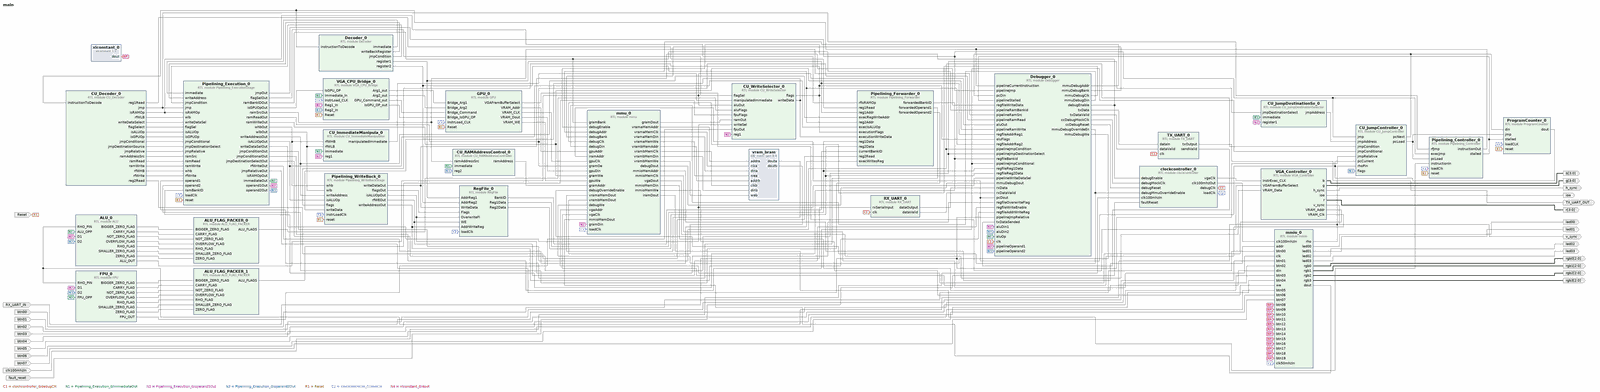
[diagram p0: block diagram of the top level, whole]
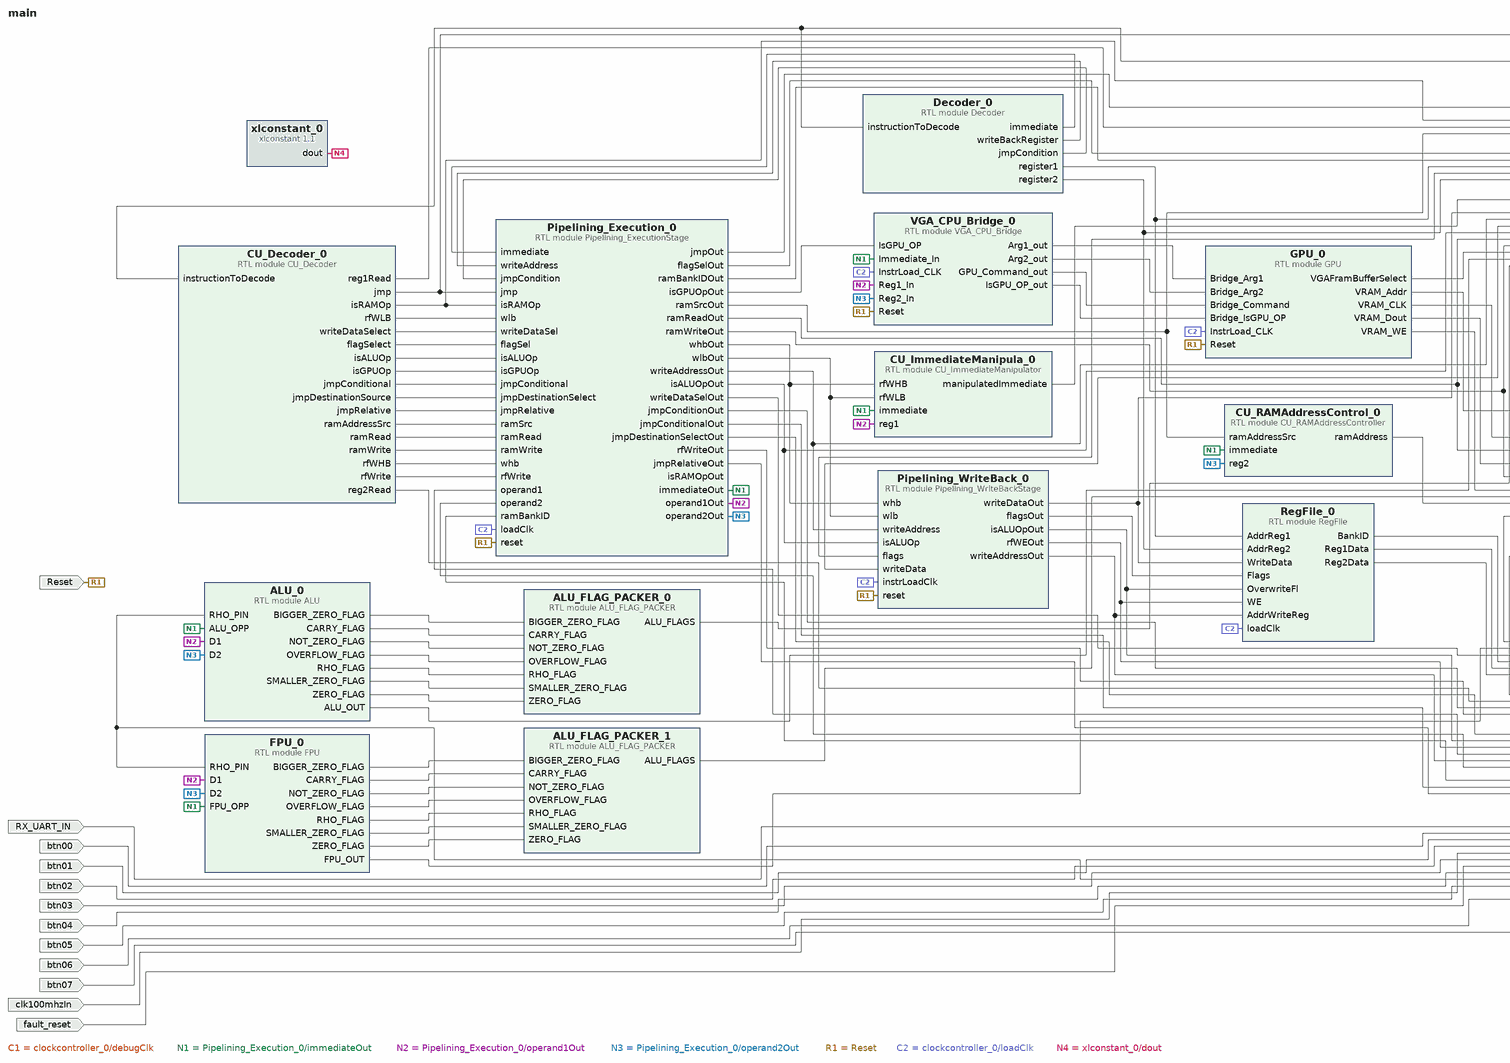
[diagram p1: block diagram of the top level, left part]
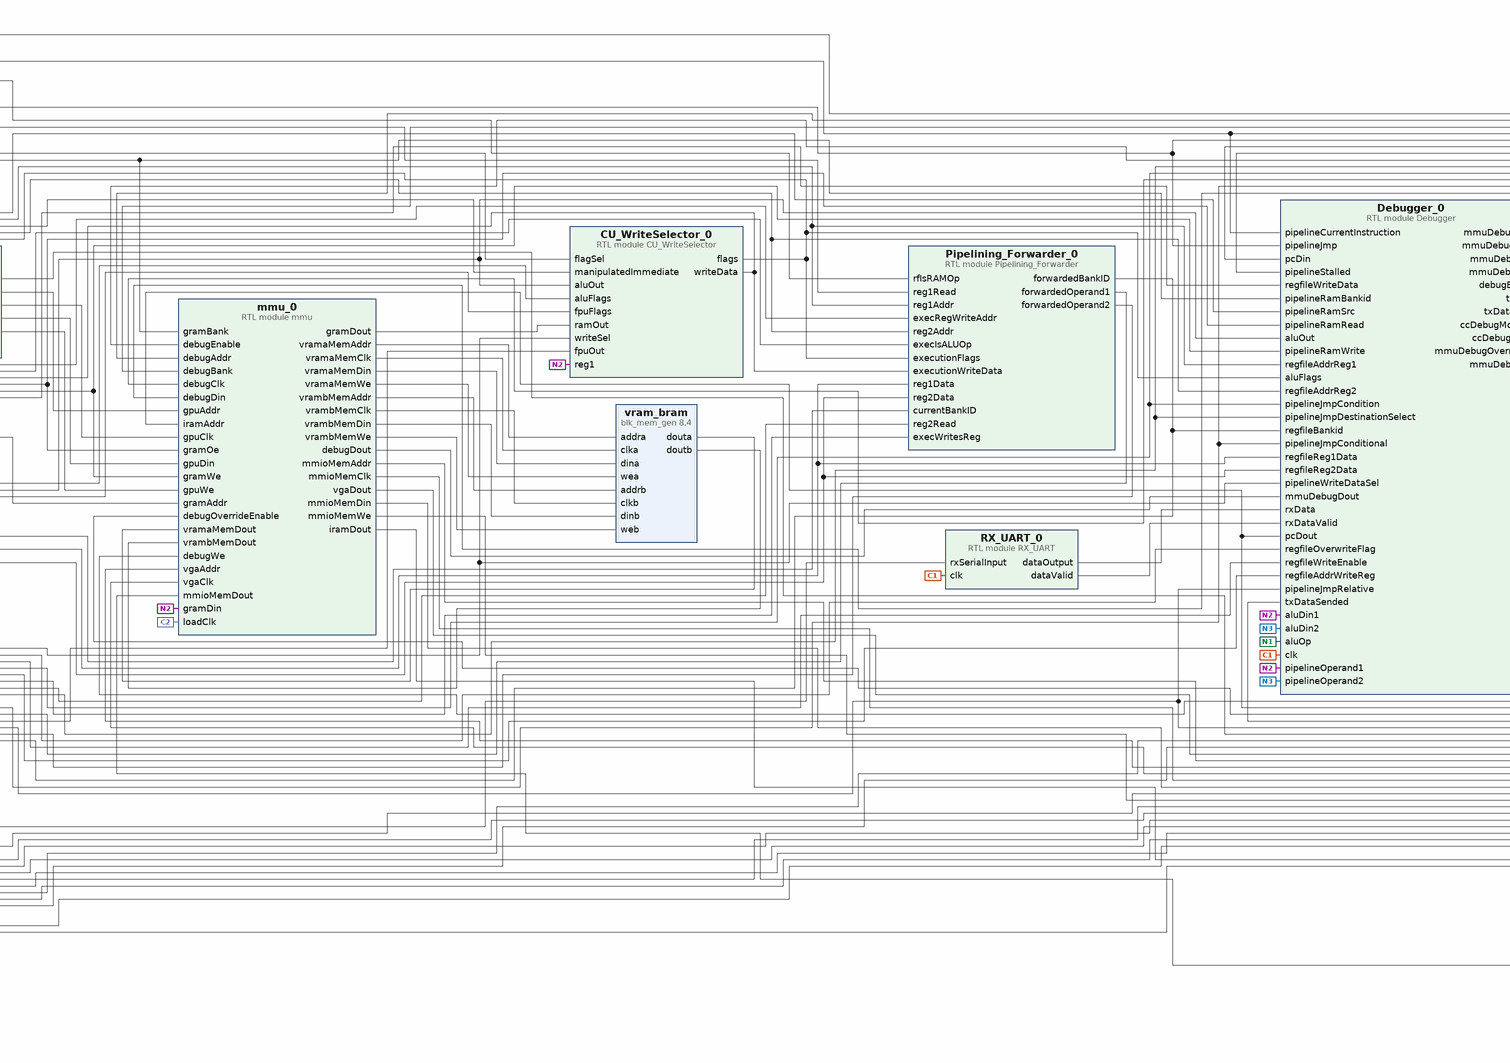
[diagram p2: block diagram of the top level, centre part]
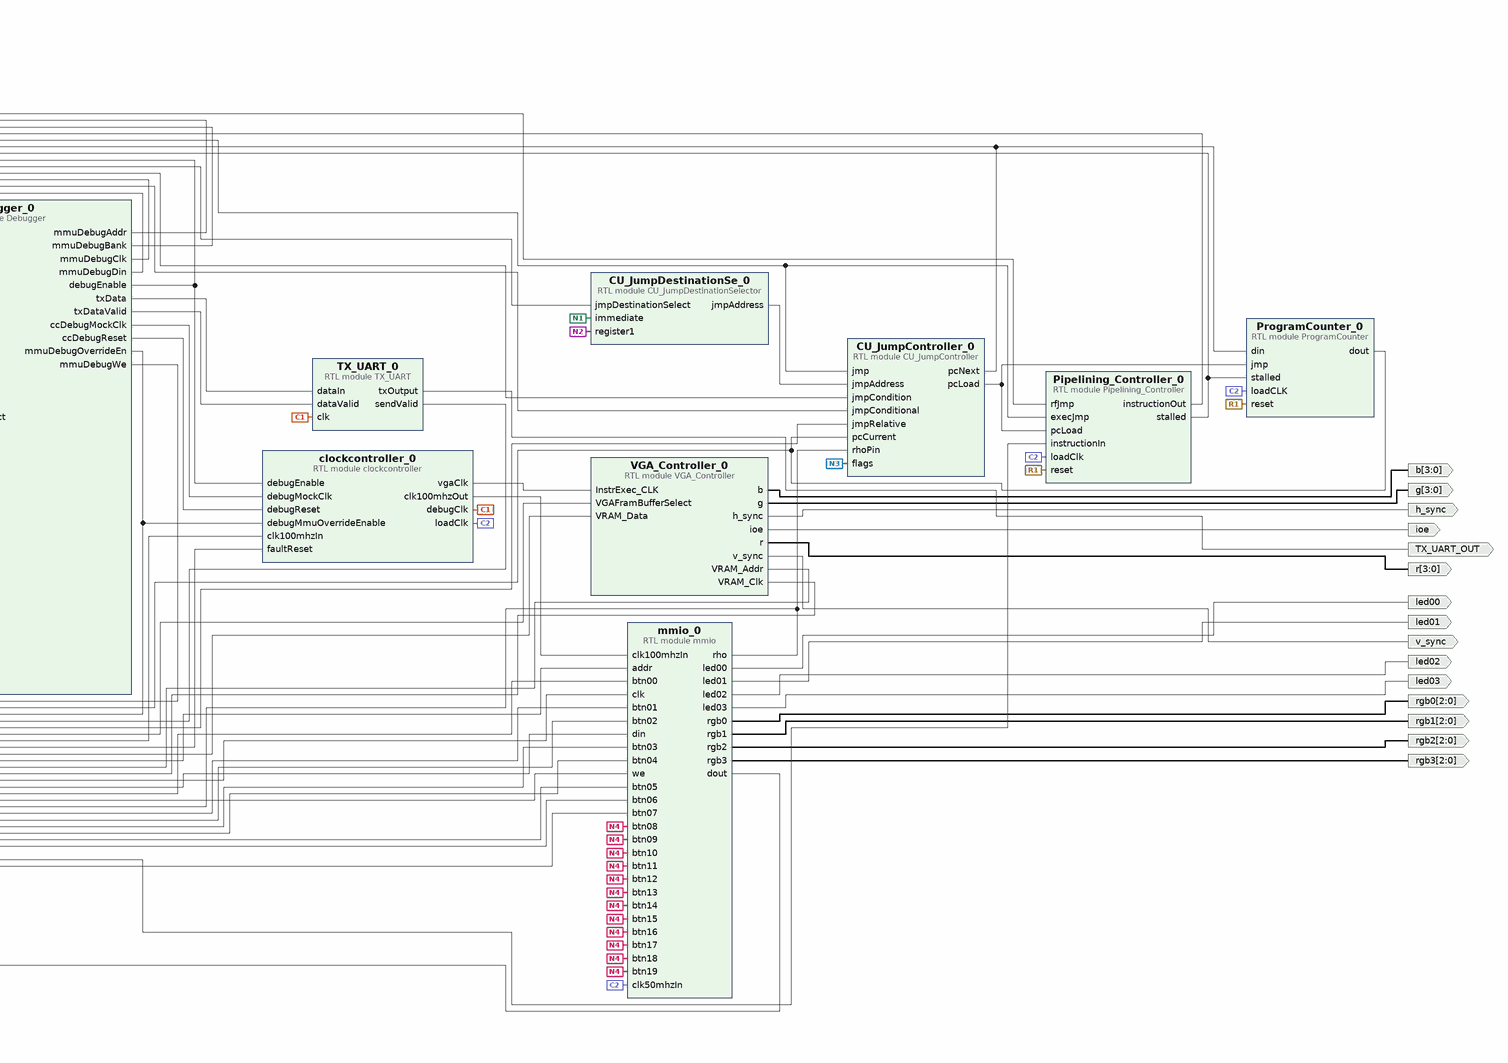
[diagram p3: block diagram of the top level, right part]
# Vivado block design main, xc7a35ticsg324-1L, Vivado 2024.1
create_bd_design main

create_bd_port -dir I -type rst Reset
create_bd_port -dir I RX_UART_IN
create_bd_port -dir O TX_UART_OUT
create_bd_port -dir O -from 3 -to 0 r
create_bd_port -dir O -from 3 -to 0 g
create_bd_port -dir O -from 3 -to 0 b
create_bd_port -dir O ioe
create_bd_port -dir O h_sync
create_bd_port -dir O v_sync
create_bd_port -dir I -type rst fault_reset
create_bd_port -dir O led00
create_bd_port -dir O led01
create_bd_port -dir O led02
create_bd_port -dir O led03
create_bd_port -dir O -from 2 -to 0 rgb0
create_bd_port -dir O -from 2 -to 0 rgb1
create_bd_port -dir O -from 2 -to 0 rgb2
create_bd_port -dir O -from 2 -to 0 rgb3
create_bd_port -dir I btn00
create_bd_port -dir I btn01
create_bd_port -dir I btn02
create_bd_port -dir I btn03
create_bd_port -dir I -type clk clk100mhzIn
set_property -dict {CONFIG.FREQ_HZ 100000000} [get_bd_ports clk100mhzIn]
create_bd_port -dir I btn04
create_bd_port -dir I btn05
create_bd_port -dir I btn06
create_bd_port -dir I btn07

create_bd_cell -type module -reference Pipelining_Controller Pipelining_Controller_0
create_bd_cell -type module -reference ProgramCounter ProgramCounter_0
create_bd_cell -type module -reference CU_Decoder CU_Decoder_0
create_bd_cell -type module -reference Decoder Decoder_0
create_bd_cell -type module -reference RegFile RegFile_0
create_bd_cell -type module -reference Pipelining_Forwarder Pipelining_Forwarder_0
create_bd_cell -type module -reference Pipelining_ExecutionStage Pipelining_Execution_0
create_bd_cell -type module -reference CU_RAMAddressController CU_RAMAddressControl_0
create_bd_cell -type module -reference ALU ALU_0
create_bd_cell -type module -reference CU_ImmediateManipulator CU_ImmediateManipula_0
create_bd_cell -type module -reference CU_JumpDestinationSelector CU_JumpDestinationSe_0
create_bd_cell -type module -reference CU_JumpController CU_JumpController_0
create_bd_cell -type module -reference CU_WriteSelector CU_WriteSelector_0
create_bd_cell -type module -reference Pipelining_WriteBackStage Pipelining_WriteBack_0
create_bd_cell -type module -reference ALU_FLAG_PACKER ALU_FLAG_PACKER_0
create_bd_cell -type module -reference clockcontroller clockcontroller_0
create_bd_cell -type module -reference mmu mmu_0
create_bd_cell -type module -reference mmio mmio_0
create_bd_cell -type ip -vlnv xilinx.com:ip:blk_mem_gen:8.4 vram_bram
set_property -dict [list \
  CONFIG.Algorithm Fixed_Primitives \
  CONFIG.Enable_A Always_Enabled \
  CONFIG.Enable_B Always_Enabled \
  CONFIG.Memory_Type True_Dual_Port_RAM \
  CONFIG.Operating_Mode_A READ_FIRST \
  CONFIG.Operating_Mode_B READ_FIRST \
  CONFIG.Primitive 8kx2 \
  CONFIG.Register_PortA_Output_of_Memory_Primitives false \
  CONFIG.Register_PortB_Output_of_Memory_Primitives true \
  CONFIG.Write_Depth_A 65535 \
  CONFIG.Write_Width_A 12 \
  CONFIG.use_bram_block Stand_Alone \
] [get_bd_cells vram_bram]
create_bd_cell -type module -reference Debugger Debugger_0
create_bd_cell -type module -reference RX_UART RX_UART_0
create_bd_cell -type module -reference TX_UART TX_UART_0
create_bd_cell -type module -reference VGA_CPU_Bridge VGA_CPU_Bridge_0
create_bd_cell -type module -reference GPU GPU_0
create_bd_cell -type module -reference VGA_Controller VGA_Controller_0
create_bd_cell -type module -reference FPU FPU_0
create_bd_cell -type module -reference ALU_FLAG_PACKER ALU_FLAG_PACKER_1
create_bd_cell -type ip -vlnv xilinx.com:ip:xlconstant:1.1 xlconstant_0
set_property -dict {CONFIG.CONST_VAL 0} [get_bd_cells xlconstant_0]

# ---- connections ----

connect_bd_net [get_bd_pins ALU_0/ALU_OUT] [get_bd_pins CU_WriteSelector_0/aluOut] [get_bd_pins Debugger_0/aluOut]
connect_bd_net [get_bd_pins ALU_0/BIGGER_ZERO_FLAG] [get_bd_pins ALU_FLAG_PACKER_0/BIGGER_ZERO_FLAG]
connect_bd_net [get_bd_pins ALU_0/CARRY_FLAG] [get_bd_pins ALU_FLAG_PACKER_0/CARRY_FLAG]
connect_bd_net [get_bd_pins ALU_0/NOT_ZERO_FLAG] [get_bd_pins ALU_FLAG_PACKER_0/NOT_ZERO_FLAG]
connect_bd_net [get_bd_pins ALU_0/OVERFLOW_FLAG] [get_bd_pins ALU_FLAG_PACKER_0/OVERFLOW_FLAG]
connect_bd_net [get_bd_pins ALU_0/RHO_FLAG] [get_bd_pins ALU_FLAG_PACKER_0/RHO_FLAG]
connect_bd_net [get_bd_pins ALU_0/SMALLER_ZERO_FLAG] [get_bd_pins ALU_FLAG_PACKER_0/SMALLER_ZERO_FLAG]
connect_bd_net [get_bd_pins ALU_0/ZERO_FLAG] [get_bd_pins ALU_FLAG_PACKER_0/ZERO_FLAG]
connect_bd_net -net ALU_FLAG_PACKER_0_ALU_FLAGS [get_bd_pins CU_WriteSelector_0/flags] \
  [get_bd_pins Debugger_0/aluFlags] [get_bd_pins Pipelining_Forwarder_0/executionFlags] \
  [get_bd_pins Pipelining_WriteBack_0/flags]
connect_bd_net [get_bd_pins ALU_FLAG_PACKER_0/ALU_FLAGS] [get_bd_pins CU_WriteSelector_0/aluFlags]
connect_bd_net [get_bd_pins ALU_FLAG_PACKER_1/ALU_FLAGS] [get_bd_pins CU_WriteSelector_0/fpuFlags]
connect_bd_net [get_bd_pins CU_Decoder_0/jmp] [get_bd_pins Pipelining_Controller_0/rfJmp] [get_bd_pins Pipelining_Execution_0/jmp]
connect_bd_net -net CU_Decoder_0_RF_WLB [get_bd_pins CU_Decoder_0/rfWLB] [get_bd_pins Pipelining_Execution_0/wlb]
connect_bd_net -net CU_Decoder_0_Write_Data_Sel [get_bd_pins CU_Decoder_0/writeDataSelect] [get_bd_pins Pipelining_Execution_0/writeDataSel]
connect_bd_net [get_bd_pins CU_Decoder_0/flagSelect] [get_bd_pins Pipelining_Execution_0/flagSel]
connect_bd_net [get_bd_pins CU_Decoder_0/isALUOp] [get_bd_pins Pipelining_Execution_0/isALUOp]
connect_bd_net [get_bd_pins CU_Decoder_0/isGPUOp] [get_bd_pins Pipelining_Execution_0/isGPUOp]
connect_bd_net [get_bd_pins CU_Decoder_0/isRAMOp] [get_bd_pins Pipelining_Execution_0/isRAMOp] [get_bd_pins Pipelining_Forwarder_0/rfIsRAMOp]
connect_bd_net [get_bd_pins CU_Decoder_0/jmpConditional] [get_bd_pins Pipelining_Execution_0/jmpConditional]
connect_bd_net [get_bd_pins CU_Decoder_0/jmpDestinationSource] [get_bd_pins Pipelining_Execution_0/jmpDestinationSelect]
connect_bd_net [get_bd_pins CU_Decoder_0/jmpRelative] [get_bd_pins Pipelining_Execution_0/jmpRelative]
connect_bd_net [get_bd_pins CU_Decoder_0/ramAddressSrc] [get_bd_pins Pipelining_Execution_0/ramSrc]
connect_bd_net [get_bd_pins CU_Decoder_0/ramRead] [get_bd_pins Pipelining_Execution_0/ramRead]
connect_bd_net [get_bd_pins CU_Decoder_0/ramWrite] [get_bd_pins Pipelining_Execution_0/ramWrite]
connect_bd_net [get_bd_pins CU_Decoder_0/reg1Read] [get_bd_pins Pipelining_Forwarder_0/reg1Read]
connect_bd_net [get_bd_pins CU_Decoder_0/reg2Read] [get_bd_pins Pipelining_Forwarder_0/reg2Read]
connect_bd_net [get_bd_pins CU_Decoder_0/rfWHB] [get_bd_pins Pipelining_Execution_0/whb]
connect_bd_net [get_bd_pins CU_Decoder_0/rfWrite] [get_bd_pins Pipelining_Execution_0/rfWrite]
connect_bd_net [get_bd_pins CU_ImmediateManipula_0/manipulatedImmediate] [get_bd_pins CU_WriteSelector_0/manipulatedImmediate]
connect_bd_net -net CU_JumpController_0_PC_Load [get_bd_pins CU_JumpController_0/pcLoad] \
  [get_bd_pins Pipelining_Controller_0/pcLoad] [get_bd_pins ProgramCounter_0/jmp]
connect_bd_net -net CU_JumpController_0_PC_Next [get_bd_pins CU_JumpController_0/pcNext] \
  [get_bd_pins Debugger_0/pcDin] [get_bd_pins ProgramCounter_0/din]
connect_bd_net [get_bd_pins CU_JumpDestinationSe_0/jmpAddress] [get_bd_pins CU_JumpController_0/jmpAddress]
connect_bd_net [get_bd_pins CU_RAMAddressControl_0/ramAddress] [get_bd_pins mmu_0/gramAddr]
connect_bd_net -net CU_WriteBackSelector_0_writeData [get_bd_pins Pipelining_WriteBack_0/writeDataOut] \
  [get_bd_pins Debugger_0/regfileWriteData] [get_bd_pins RegFile_0/WriteData]
connect_bd_net -net CU_WriteSelector_0_Write_Data [get_bd_pins CU_WriteSelector_0/writeData] \
  [get_bd_pins Pipelining_Forwarder_0/executionWriteData] [get_bd_pins Pipelining_WriteBack_0/writeData]
connect_bd_net [get_bd_pins Debugger_0/ccDebugMockClk] [get_bd_pins clockcontroller_0/debugMockClk]
connect_bd_net [get_bd_pins Debugger_0/ccDebugReset] [get_bd_pins clockcontroller_0/debugReset]
connect_bd_net [get_bd_pins Debugger_0/debugEnable] [get_bd_pins clockcontroller_0/debugEnable] [get_bd_pins mmu_0/debugEnable]
connect_bd_net [get_bd_pins Debugger_0/mmuDebugAddr] [get_bd_pins mmu_0/debugAddr]
connect_bd_net [get_bd_pins Debugger_0/mmuDebugBank] [get_bd_pins mmu_0/debugBank]
connect_bd_net [get_bd_pins Debugger_0/mmuDebugClk] [get_bd_pins mmu_0/debugClk]
connect_bd_net [get_bd_pins Debugger_0/mmuDebugDin] [get_bd_pins mmu_0/debugDin]
connect_bd_net [get_bd_pins Debugger_0/mmuDebugOverrideEn] \
  [get_bd_pins clockcontroller_0/debugMmuOverrideEnable] [get_bd_pins mmu_0/debugOverrideEnable]
connect_bd_net [get_bd_pins Debugger_0/mmuDebugWe] [get_bd_pins mmu_0/debugWe]
connect_bd_net [get_bd_pins Debugger_0/txData] [get_bd_pins TX_UART_0/dataIn]
connect_bd_net [get_bd_pins Debugger_0/txDataValid] [get_bd_pins TX_UART_0/dataValid]
connect_bd_net [get_bd_pins Decoder_0/immediate] [get_bd_pins Pipelining_Execution_0/immediate]
connect_bd_net [get_bd_pins Decoder_0/register1] \
  [get_bd_pins Debugger_0/regfileAddrReg1] [get_bd_pins Pipelining_Forwarder_0/reg1Addr] [get_bd_pins RegFile_0/AddrReg1]
connect_bd_net [get_bd_pins Decoder_0/register2] \
  [get_bd_pins Debugger_0/regfileAddrReg2] [get_bd_pins Pipelining_Forwarder_0/reg2Addr] [get_bd_pins RegFile_0/AddrReg2]
connect_bd_net [get_bd_pins Decoder_0/writeBackRegister] [get_bd_pins Pipelining_Execution_0/writeAddress]
connect_bd_net [get_bd_pins Decoder_0/jmpCondition] [get_bd_pins Pipelining_Execution_0/jmpCondition]
connect_bd_net [get_bd_pins FPU_0/BIGGER_ZERO_FLAG] [get_bd_pins ALU_FLAG_PACKER_1/BIGGER_ZERO_FLAG]
connect_bd_net [get_bd_pins FPU_0/CARRY_FLAG] [get_bd_pins ALU_FLAG_PACKER_1/CARRY_FLAG]
connect_bd_net [get_bd_pins FPU_0/FPU_OUT] [get_bd_pins CU_WriteSelector_0/fpuOut]
connect_bd_net [get_bd_pins FPU_0/NOT_ZERO_FLAG] [get_bd_pins ALU_FLAG_PACKER_1/NOT_ZERO_FLAG]
connect_bd_net [get_bd_pins FPU_0/OVERFLOW_FLAG] [get_bd_pins ALU_FLAG_PACKER_1/OVERFLOW_FLAG]
connect_bd_net [get_bd_pins FPU_0/RHO_FLAG] [get_bd_pins ALU_FLAG_PACKER_1/RHO_FLAG]
connect_bd_net [get_bd_pins FPU_0/SMALLER_ZERO_FLAG] [get_bd_pins ALU_FLAG_PACKER_1/SMALLER_ZERO_FLAG]
connect_bd_net [get_bd_pins FPU_0/ZERO_FLAG] [get_bd_pins ALU_FLAG_PACKER_1/ZERO_FLAG]
connect_bd_net [get_bd_pins GPU_0/VGAFramBufferSelect] [get_bd_pins VGA_Controller_0/VGAFramBufferSelect]
connect_bd_net [get_bd_pins GPU_0/VRAM_Addr] [get_bd_pins mmu_0/gpuAddr]
connect_bd_net [get_bd_pins GPU_0/VRAM_CLK] [get_bd_pins mmu_0/gpuClk]
connect_bd_net [get_bd_pins GPU_0/VRAM_Dout] [get_bd_pins mmu_0/gpuDin]
connect_bd_net [get_bd_pins GPU_0/VRAM_WE] [get_bd_pins mmu_0/gpuWe]
connect_bd_net [get_bd_pins clockcontroller_0/debugClk] [get_bd_pins Debugger_0/clk] [get_bd_pins RX_UART_0/clk] [get_bd_pins TX_UART_0/clk]
connect_bd_net -net Pipelining_Controller_0_InstructionToExecute [get_bd_pins Pipelining_Controller_0/instructionOut] \
  [get_bd_pins CU_Decoder_0/instructionToDecode] [get_bd_pins Debugger_0/pipelineCurrentInstruction] \
  [get_bd_pins Decoder_0/instructionToDecode]
connect_bd_net [get_bd_pins Pipelining_Controller_0/stalled] [get_bd_pins Debugger_0/pipelineStalled] [get_bd_pins ProgramCounter_0/stalled]
connect_bd_net -net Pipelining_Execution_0_Immediate_out [get_bd_pins Pipelining_Execution_0/immediateOut] \
  [get_bd_pins ALU_0/ALU_OPP] [get_bd_pins CU_ImmediateManipula_0/immediate] [get_bd_pins CU_JumpDestinationSe_0/immediate] \
  [get_bd_pins CU_RAMAddressControl_0/immediate] [get_bd_pins Debugger_0/aluOp] [get_bd_pins FPU_0/FPU_OPP] \
  [get_bd_pins VGA_CPU_Bridge_0/Immediate_In]
connect_bd_net -net Pipelining_Execution_0_Is_GPU_OP_out [get_bd_pins Pipelining_Execution_0/isGPUOpOut] [get_bd_pins VGA_CPU_Bridge_0/IsGPU_OP]
connect_bd_net -net Pipelining_Execution_0_JMP_out [get_bd_pins Pipelining_Execution_0/jmpOut] \
  [get_bd_pins CU_JumpController_0/jmp] [get_bd_pins Debugger_0/pipelineJmp] [get_bd_pins Pipelining_Controller_0/execJmp]
connect_bd_net -net Pipelining_Execution_0_Operand1_out [get_bd_pins Pipelining_Execution_0/operand1Out] \
  [get_bd_pins ALU_0/D1] [get_bd_pins CU_ImmediateManipula_0/reg1] [get_bd_pins CU_JumpDestinationSe_0/register1] \
  [get_bd_pins CU_WriteSelector_0/reg1] [get_bd_pins Debugger_0/pipelineOperand1] [get_bd_pins Debugger_0/aluDin1] \
  [get_bd_pins FPU_0/D1] [get_bd_pins VGA_CPU_Bridge_0/Reg1_In] [get_bd_pins mmu_0/gramDin]
connect_bd_net -net Pipelining_Execution_0_Operand2_out [get_bd_pins Pipelining_Execution_0/operand2Out] \
  [get_bd_pins ALU_0/D2] [get_bd_pins CU_JumpController_0/flags] [get_bd_pins CU_RAMAddressControl_0/reg2] \
  [get_bd_pins Debugger_0/pipelineOperand2] [get_bd_pins Debugger_0/aluDin2] [get_bd_pins FPU_0/D2] \
  [get_bd_pins VGA_CPU_Bridge_0/Reg2_In]
connect_bd_net -net Pipelining_Execution_0_WriteAddress_out [get_bd_pins Pipelining_Execution_0/writeAddressOut] \
  [get_bd_pins Pipelining_Forwarder_0/execRegWriteAddr] [get_bd_pins Pipelining_WriteBack_0/writeAddress]
connect_bd_net [get_bd_pins Pipelining_Execution_0/flagSelOut] [get_bd_pins CU_WriteSelector_0/flagSel]
connect_bd_net [get_bd_pins Pipelining_Execution_0/isALUOpOut] \
  [get_bd_pins Pipelining_Forwarder_0/execIsALUOp] [get_bd_pins Pipelining_WriteBack_0/isALUOp]
# net Pipelining_Execution_0_isRAMOpOut has one end: Pipelining_Execution_0/isRAMOpOut
connect_bd_net [get_bd_pins Pipelining_Execution_0/jmpConditionOut] \
  [get_bd_pins CU_JumpController_0/jmpCondition] [get_bd_pins Debugger_0/pipelineJmpCondition]
connect_bd_net [get_bd_pins Pipelining_Execution_0/jmpConditionalOut] \
  [get_bd_pins CU_JumpController_0/jmpConditional] [get_bd_pins Debugger_0/pipelineJmpConditional]
connect_bd_net [get_bd_pins Pipelining_Execution_0/jmpDestinationSelectOut] \
  [get_bd_pins CU_JumpDestinationSe_0/jmpDestinationSelect] [get_bd_pins Debugger_0/pipelineJmpDestinationSelect]
connect_bd_net [get_bd_pins Pipelining_Execution_0/jmpRelativeOut] \
  [get_bd_pins CU_JumpController_0/jmpRelative] [get_bd_pins Debugger_0/pipelineJmpRelative]
connect_bd_net [get_bd_pins Pipelining_Execution_0/ramBankIDOut] [get_bd_pins Debugger_0/pipelineRamBankid] [get_bd_pins mmu_0/gramBank]
connect_bd_net [get_bd_pins Pipelining_Execution_0/ramReadOut] [get_bd_pins Debugger_0/pipelineRamRead] [get_bd_pins mmu_0/gramOe]
connect_bd_net [get_bd_pins Pipelining_Execution_0/ramSrcOut] \
  [get_bd_pins CU_RAMAddressControl_0/ramAddressSrc] [get_bd_pins Debugger_0/pipelineRamSrc]
connect_bd_net [get_bd_pins Pipelining_Execution_0/ramWriteOut] [get_bd_pins Debugger_0/pipelineRamWrite] [get_bd_pins mmu_0/gramWe]
connect_bd_net [get_bd_pins Pipelining_Execution_0/rfWriteOut] [get_bd_pins Pipelining_Forwarder_0/execWritesReg]
connect_bd_net [get_bd_pins Pipelining_Execution_0/whbOut] [get_bd_pins CU_ImmediateManipula_0/rfWHB] [get_bd_pins Pipelining_WriteBack_0/whb]
connect_bd_net [get_bd_pins Pipelining_Execution_0/wlbOut] [get_bd_pins CU_ImmediateManipula_0/rfWLB] [get_bd_pins Pipelining_WriteBack_0/wlb]
connect_bd_net [get_bd_pins Pipelining_Execution_0/writeDataSelOut] \
  [get_bd_pins CU_WriteSelector_0/writeSel] [get_bd_pins Debugger_0/pipelineWriteDataSel]
connect_bd_net [get_bd_pins Pipelining_Forwarder_0/forwardedOperand1] [get_bd_pins Pipelining_Execution_0/operand1]
connect_bd_net [get_bd_pins Pipelining_Forwarder_0/forwardedOperand2] [get_bd_pins Pipelining_Execution_0/operand2]
connect_bd_net -net Pipelining_WriteBack_0_Flags_out [get_bd_pins Pipelining_WriteBack_0/flagsOut] [get_bd_pins RegFile_0/Flags]
connect_bd_net -net Pipelining_WriteBack_0_Is_ALU_OP_out [get_bd_pins Pipelining_WriteBack_0/isALUOpOut] \
  [get_bd_pins Debugger_0/regfileOverwriteFlag] [get_bd_pins RegFile_0/OverwriteFl]
connect_bd_net -net Pipelining_WriteBack_0_RF_WE_out [get_bd_pins Pipelining_WriteBack_0/rfWEOut] \
  [get_bd_pins Debugger_0/regfileWriteEnable] [get_bd_pins RegFile_0/WE]
connect_bd_net -net Pipelining_WriteBack_0_WriteAddress_out [get_bd_pins Pipelining_WriteBack_0/writeAddressOut] \
  [get_bd_pins Debugger_0/regfileAddrWriteReg] [get_bd_pins RegFile_0/AddrWriteReg]
connect_bd_net [get_bd_pins ProgramCounter_0/dout] \
  [get_bd_pins CU_JumpController_0/pcCurrent] [get_bd_pins Debugger_0/pcDout] [get_bd_pins mmu_0/iramAddr]
connect_bd_net [get_bd_pins RX_UART_0/dataOutput] [get_bd_pins Debugger_0/rxData]
connect_bd_net [get_bd_pins RX_UART_0/dataValid] [get_bd_pins Debugger_0/rxDataValid]
connect_bd_net [get_bd_ports RX_UART_IN] [get_bd_pins RX_UART_0/rxSerialInput]
connect_bd_net -net RegFile_0_BankID [get_bd_pins Pipelining_Forwarder_0/forwardedBankID] \
  [get_bd_pins Debugger_0/regfileBankid] [get_bd_pins Pipelining_Execution_0/ramBankID]
connect_bd_net [get_bd_pins RegFile_0/BankID] [get_bd_pins Pipelining_Forwarder_0/currentBankID]
connect_bd_net [get_bd_pins RegFile_0/Reg1Data] [get_bd_pins Debugger_0/regfileReg1Data] [get_bd_pins Pipelining_Forwarder_0/reg1Data]
connect_bd_net [get_bd_pins RegFile_0/Reg2Data] [get_bd_pins Debugger_0/regfileReg2Data] [get_bd_pins Pipelining_Forwarder_0/reg2Data]
connect_bd_net [get_bd_ports Reset] \
  [get_bd_pins GPU_0/Reset] [get_bd_pins Pipelining_Controller_0/reset] [get_bd_pins Pipelining_Execution_0/reset] \
  [get_bd_pins Pipelining_WriteBack_0/reset] [get_bd_pins ProgramCounter_0/reset] [get_bd_pins VGA_CPU_Bridge_0/Reset]
connect_bd_net [get_bd_pins TX_UART_0/sendValid] [get_bd_pins Debugger_0/txDataSended]
connect_bd_net -net TX_UART_0_tx_output [get_bd_pins TX_UART_0/txOutput] [get_bd_ports TX_UART_OUT]
connect_bd_net [get_bd_pins VGA_CPU_Bridge_0/Arg1_out] [get_bd_pins GPU_0/Bridge_Arg1]
connect_bd_net [get_bd_pins VGA_CPU_Bridge_0/Arg2_out] [get_bd_pins GPU_0/Bridge_Arg2]
connect_bd_net [get_bd_pins VGA_CPU_Bridge_0/GPU_Command_out] [get_bd_pins GPU_0/Bridge_Command]
connect_bd_net [get_bd_pins VGA_CPU_Bridge_0/IsGPU_OP_out] [get_bd_pins GPU_0/Bridge_IsGPU_OP]
connect_bd_net [get_bd_pins VGA_Controller_0/VRAM_Addr] [get_bd_pins mmu_0/vgaAddr]
connect_bd_net [get_bd_pins VGA_Controller_0/VRAM_Clk] [get_bd_pins mmu_0/vgaClk]
connect_bd_net [get_bd_pins VGA_Controller_0/b] [get_bd_ports b]
connect_bd_net [get_bd_pins VGA_Controller_0/g] [get_bd_ports g]
connect_bd_net [get_bd_pins VGA_Controller_0/h_sync] [get_bd_ports h_sync]
connect_bd_net [get_bd_pins VGA_Controller_0/ioe] [get_bd_ports ioe]
connect_bd_net [get_bd_pins VGA_Controller_0/r] [get_bd_ports r]
connect_bd_net [get_bd_pins VGA_Controller_0/v_sync] [get_bd_ports v_sync]
connect_bd_net -net btn00_1 [get_bd_ports btn00] [get_bd_pins mmio_0/btn00]
connect_bd_net -net btn01_1 [get_bd_ports btn01] [get_bd_pins mmio_0/btn01]
connect_bd_net -net btn02_1 [get_bd_ports btn02] [get_bd_pins mmio_0/btn02]
connect_bd_net -net btn03_1 [get_bd_ports btn03] [get_bd_pins mmio_0/btn03]
connect_bd_net -net btn04_1 [get_bd_ports btn04] [get_bd_pins mmio_0/btn04]
connect_bd_net -net btn05_1 [get_bd_ports btn05] [get_bd_pins mmio_0/btn05]
connect_bd_net -net btn06_1 [get_bd_ports btn06] [get_bd_pins mmio_0/btn06]
connect_bd_net -net btn07_1 [get_bd_ports btn07] [get_bd_pins mmio_0/btn07]
connect_bd_net [get_bd_ports clk100mhzIn] [get_bd_pins clockcontroller_0/clk100mhzIn]
connect_bd_net [get_bd_pins clockcontroller_0/clk100mhzOut] [get_bd_pins mmio_0/clk100mhzIn]
connect_bd_net [get_bd_pins clockcontroller_0/loadClk] \
  [get_bd_pins GPU_0/InstrLoad_CLK] [get_bd_pins Pipelining_Controller_0/loadClk] \
  [get_bd_pins Pipelining_Execution_0/loadClk] [get_bd_pins Pipelining_WriteBack_0/instrLoadClk] \
  [get_bd_pins ProgramCounter_0/loadCLK] [get_bd_pins RegFile_0/loadClk] [get_bd_pins VGA_CPU_Bridge_0/InstrLoad_CLK] \
  [get_bd_pins mmio_0/clk50mhzIn] [get_bd_pins mmu_0/loadClk]
connect_bd_net -net clockcontroller_0_vga_clk [get_bd_pins clockcontroller_0/vgaClk] [get_bd_pins VGA_Controller_0/InstrExec_CLK]
connect_bd_net [get_bd_ports fault_reset] [get_bd_pins clockcontroller_0/faultReset]
connect_bd_net [get_bd_pins mmio_0/dout] [get_bd_pins mmu_0/mmioMemDout]
connect_bd_net [get_bd_pins mmio_0/led00] [get_bd_ports led00]
connect_bd_net [get_bd_pins mmio_0/led01] [get_bd_ports led01]
connect_bd_net [get_bd_pins mmio_0/led02] [get_bd_ports led02]
connect_bd_net [get_bd_pins mmio_0/led03] [get_bd_ports led03]
connect_bd_net [get_bd_pins mmio_0/rgb0] [get_bd_ports rgb0]
connect_bd_net [get_bd_pins mmio_0/rgb1] [get_bd_ports rgb1]
connect_bd_net [get_bd_pins mmio_0/rgb2] [get_bd_ports rgb2]
connect_bd_net [get_bd_pins mmio_0/rgb3] [get_bd_ports rgb3]
connect_bd_net [get_bd_pins mmio_0/rho] [get_bd_pins ALU_0/RHO_PIN] [get_bd_pins CU_JumpController_0/rhoPin] [get_bd_pins FPU_0/RHO_PIN]
connect_bd_net [get_bd_pins mmu_0/debugDout] [get_bd_pins Debugger_0/mmuDebugDout]
connect_bd_net [get_bd_pins mmu_0/gramDout] [get_bd_pins CU_WriteSelector_0/ramOut]
connect_bd_net [get_bd_pins mmu_0/iramDout] [get_bd_pins Pipelining_Controller_0/instructionIn]
connect_bd_net -net mmu_0_mmio_mem_addr [get_bd_pins mmu_0/mmioMemAddr] [get_bd_pins mmio_0/addr]
connect_bd_net -net mmu_0_mmio_mem_ck [get_bd_pins mmu_0/mmioMemClk] [get_bd_pins mmio_0/clk]
connect_bd_net -net mmu_0_mmio_mem_din [get_bd_pins mmu_0/mmioMemDin] [get_bd_pins mmio_0/din]
connect_bd_net -net mmu_0_mmio_mem_we [get_bd_pins mmu_0/mmioMemWe] [get_bd_pins mmio_0/we]
connect_bd_net -net mmu_0_vga_dout [get_bd_pins mmu_0/vgaDout] [get_bd_pins VGA_Controller_0/VRAM_Data]
connect_bd_net -net mmu_0_vrama_mem_addr [get_bd_pins mmu_0/vramaMemAddr] [get_bd_pins vram_bram/addra]
connect_bd_net -net mmu_0_vrama_mem_ck [get_bd_pins mmu_0/vramaMemClk] [get_bd_pins vram_bram/clka]
connect_bd_net -net mmu_0_vrama_mem_din [get_bd_pins mmu_0/vramaMemDin] [get_bd_pins vram_bram/dina]
connect_bd_net -net mmu_0_vrama_mem_we [get_bd_pins mmu_0/vramaMemWe] [get_bd_pins vram_bram/wea]
connect_bd_net -net mmu_0_vramb_mem_addr [get_bd_pins mmu_0/vrambMemAddr] [get_bd_pins vram_bram/addrb]
connect_bd_net -net mmu_0_vramb_mem_ck [get_bd_pins mmu_0/vrambMemClk] [get_bd_pins vram_bram/clkb]
connect_bd_net -net mmu_0_vramb_mem_din [get_bd_pins mmu_0/vrambMemDin] [get_bd_pins vram_bram/dinb]
connect_bd_net -net mmu_0_vramb_mem_we [get_bd_pins mmu_0/vrambMemWe] [get_bd_pins vram_bram/web]
connect_bd_net [get_bd_pins vram_bram/douta] [get_bd_pins mmu_0/vramaMemDout]
connect_bd_net [get_bd_pins vram_bram/doutb] [get_bd_pins mmu_0/vrambMemDout]
connect_bd_net [get_bd_pins xlconstant_0/dout] \
  [get_bd_pins mmio_0/btn08] [get_bd_pins mmio_0/btn09] [get_bd_pins mmio_0/btn10] [get_bd_pins mmio_0/btn11] \
  [get_bd_pins mmio_0/btn12] [get_bd_pins mmio_0/btn13] [get_bd_pins mmio_0/btn14] [get_bd_pins mmio_0/btn15] \
  [get_bd_pins mmio_0/btn16] [get_bd_pins mmio_0/btn17] [get_bd_pins mmio_0/btn18] [get_bd_pins mmio_0/btn19]

validate_bd_design
save_bd_design
